# Altium schematic sheet SPBTLE-RF_BlueTooth_Module.SchDoc
size A4; SheetNumber: 2; SheetTotal: 4
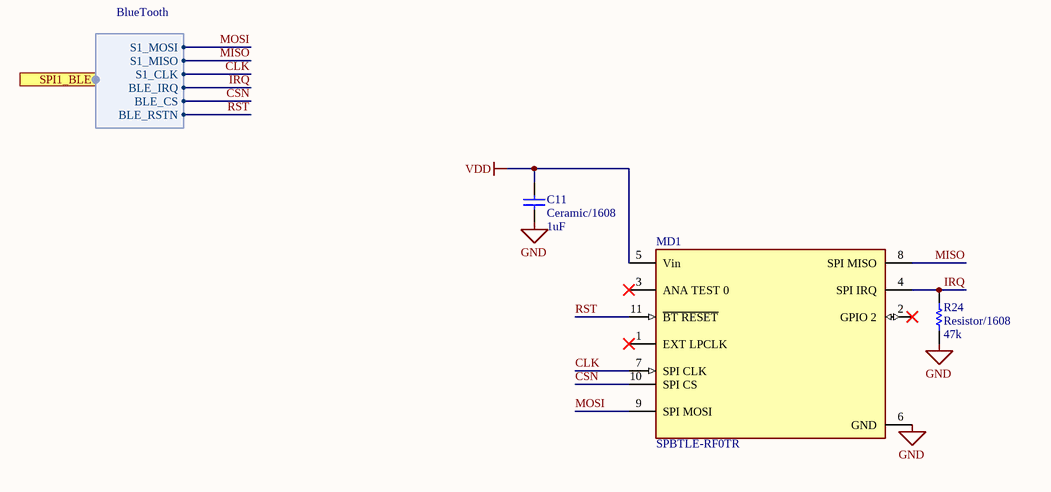
[diagram p0: SPBTLE-RF_BlueTooth_Module.SchDoc]

## Parts
C11  Ceramic/1608  value 1uF  [Generic 1608 Ceramic]
MD1  SPBTLE-RF0TR  [FP-SPBTLE-RF0TR-MFG]
R24  Resistor/1608  value 47k  [Resistor 1608-Footprint]

## Ports
SPI1_BLE (harness BlueTooth)

## Harnesses
BlueTooth: S1_CLK, S1_MISO, S1_MOSI, BLE_IRQ, BLE_CS, BLE_RSTN

## Nets
GND: C11.1 MD1.6(GND) R24.1
VDD: C11.2 MD1.5(Vin)
CLK: MD1.7(SPI_CLK) ; port SPI1_BLE.S1_CLK
CSN: MD1.10(SPI_CS) ; port SPI1_BLE.BLE_CS
IRQ: MD1.4(SPI_IRQ) R24.2 ; port SPI1_BLE.BLE_IRQ
MISO: MD1.8(SPI_MISO) ; port SPI1_BLE.S1_MISO
MOSI: MD1.9(SPI_MOSI) ; port SPI1_BLE.S1_MOSI
RST: MD1.11(~{BT_RESET}) ; port SPI1_BLE.BLE_RSTN

Not connected (* = marked no-connect by the designer): MD1 1(EXT_LPCLK)* 2(GPIO_2)* 3(ANA_TEST_0)*

## Library data of the parts
C11 = CMP-002-0009-3: Generic 1608 Ceramic Capacitor; Capacitor Type: Ceramic; Pins: 2; Mount: SMD; Case/Package: 1608; RoHS: Yes
MD1 = CMP-12160-000004-1: MOD VLP BLUETOOTH REV V4.1; Manufacturer: STMicroelectronics; Sensitivity: -88dBm; Nominal Supply Current: 0.186-14.49mA; Number Of Gpio: 1; Max Frequency: 2480MHz; Interface: SPI; Max Supply Voltage: 3.6V; Min Supply Voltage: 1.7V; Category: UNK; ComponentLink2URL: https://www.st.com/resource/en/datasheet/spbtle-rf0.pdf; Temperature Range Low: -40°C; Package: SPBTLE-RF0TR; Lead Free: Yes; Device Class L3: Transceivers; RoHS: TRUE; Height: 2.2mm; Manufacturer Part Number: SPBTLE-RF0TR; Temperature Range High: +85°C; ComponentLink2Description: Datasheet; Device Class L2: RF Semiconductors and Devices; Automotive: No; Device Class L1: Integrated Circuits (ICs); Digikey Description: MOD VLP BLUETOOTH REV V4.1; Octopart: https://octopart.com/spbtle-rf0tr-stmicroelectronics-87775406; Temperature: -40°C to +85°C
R24 = CMP-001-0018-2: Generic 1608 Resistor; Pins: 2; Case/Package: Bulk; RoHS: Yes; Mount: SMD